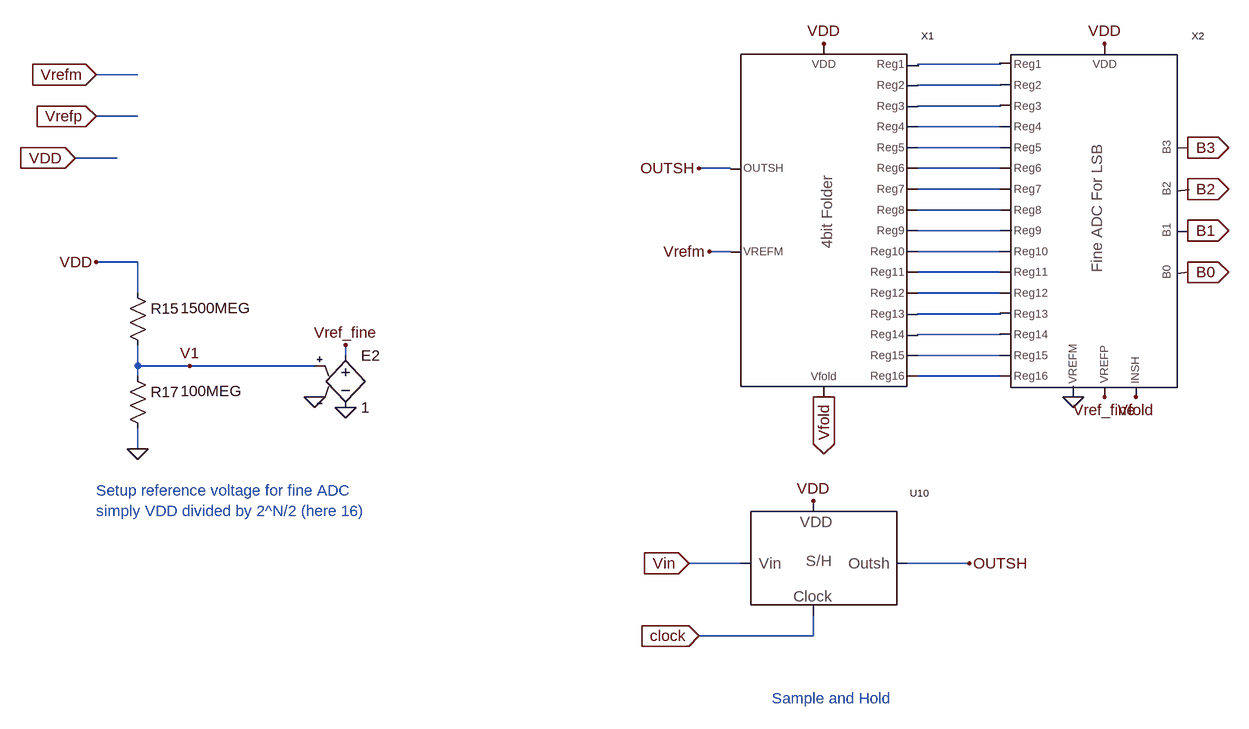
[diagram p0: schematic 4_bit_Folding_ADC.asc]
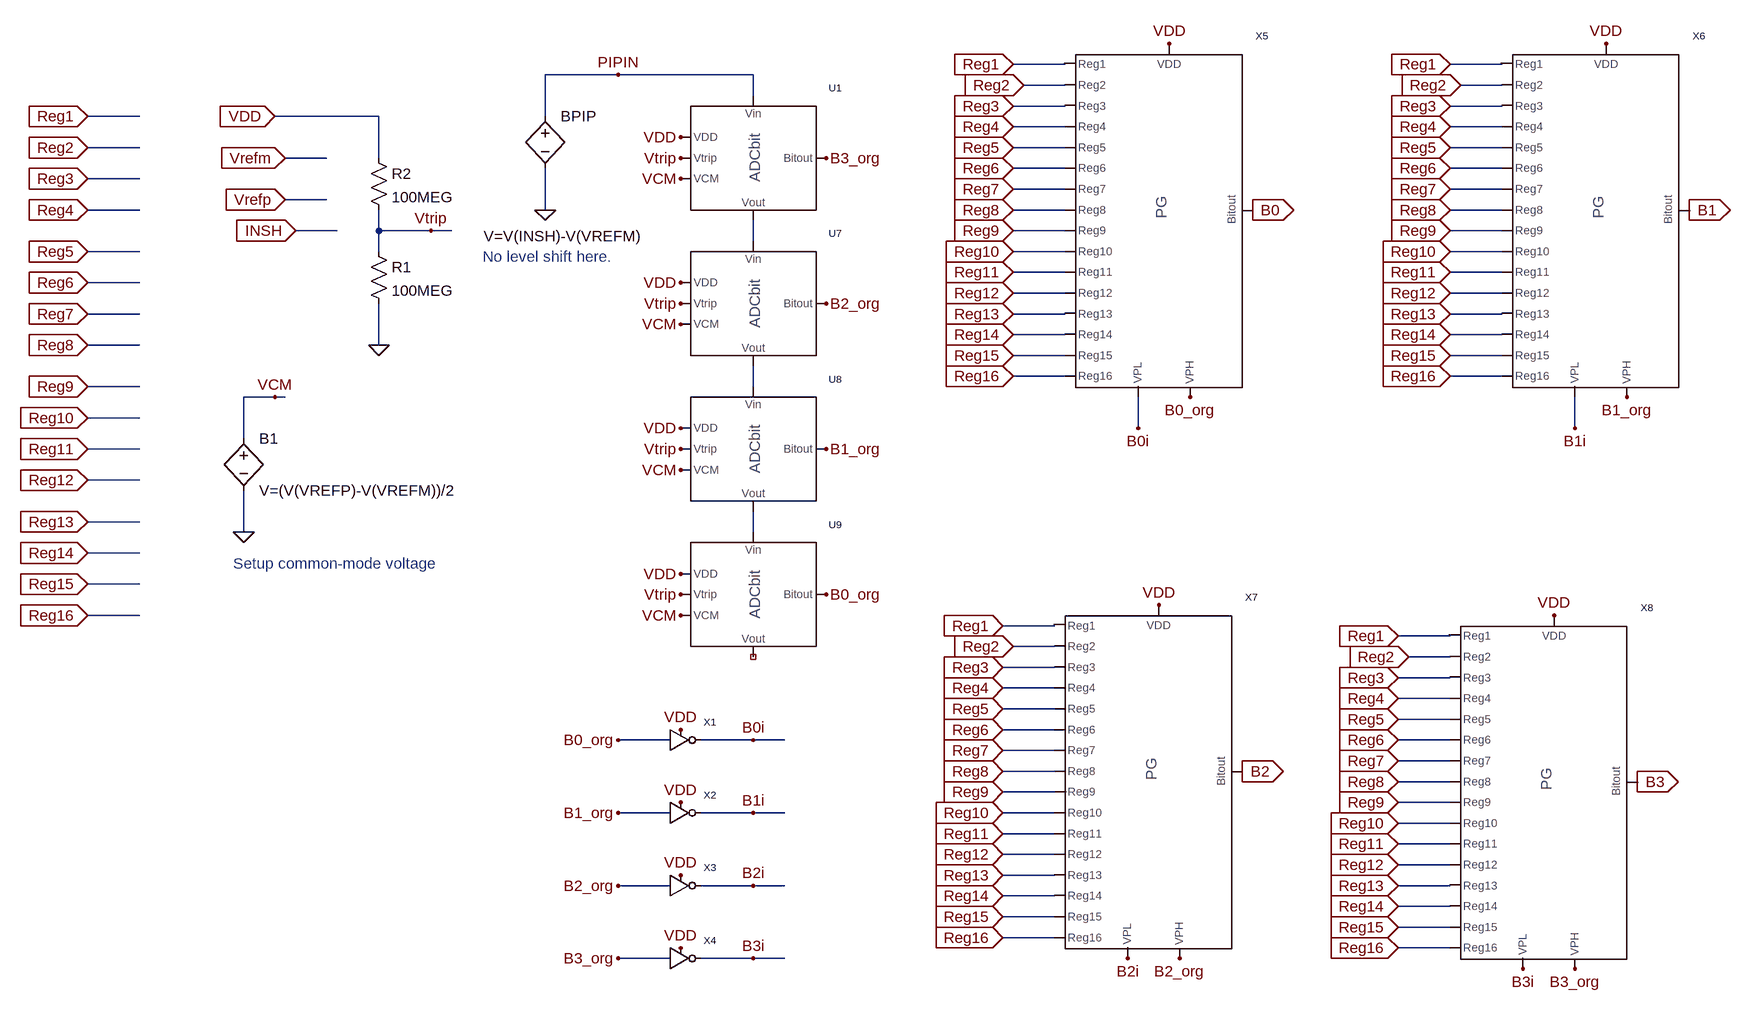
[diagram p1: sub-circuit 4_bit_fine_adc_lsb.asc]
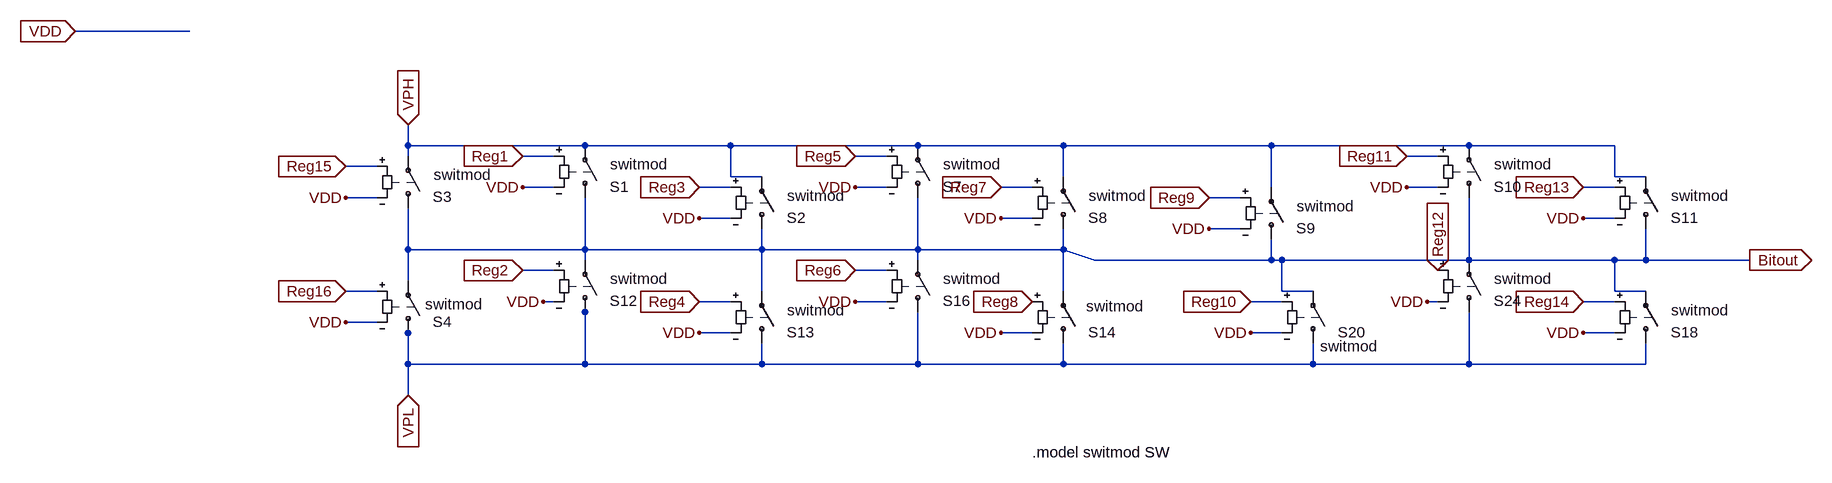
[diagram p2: sub-circuit pg.asc]
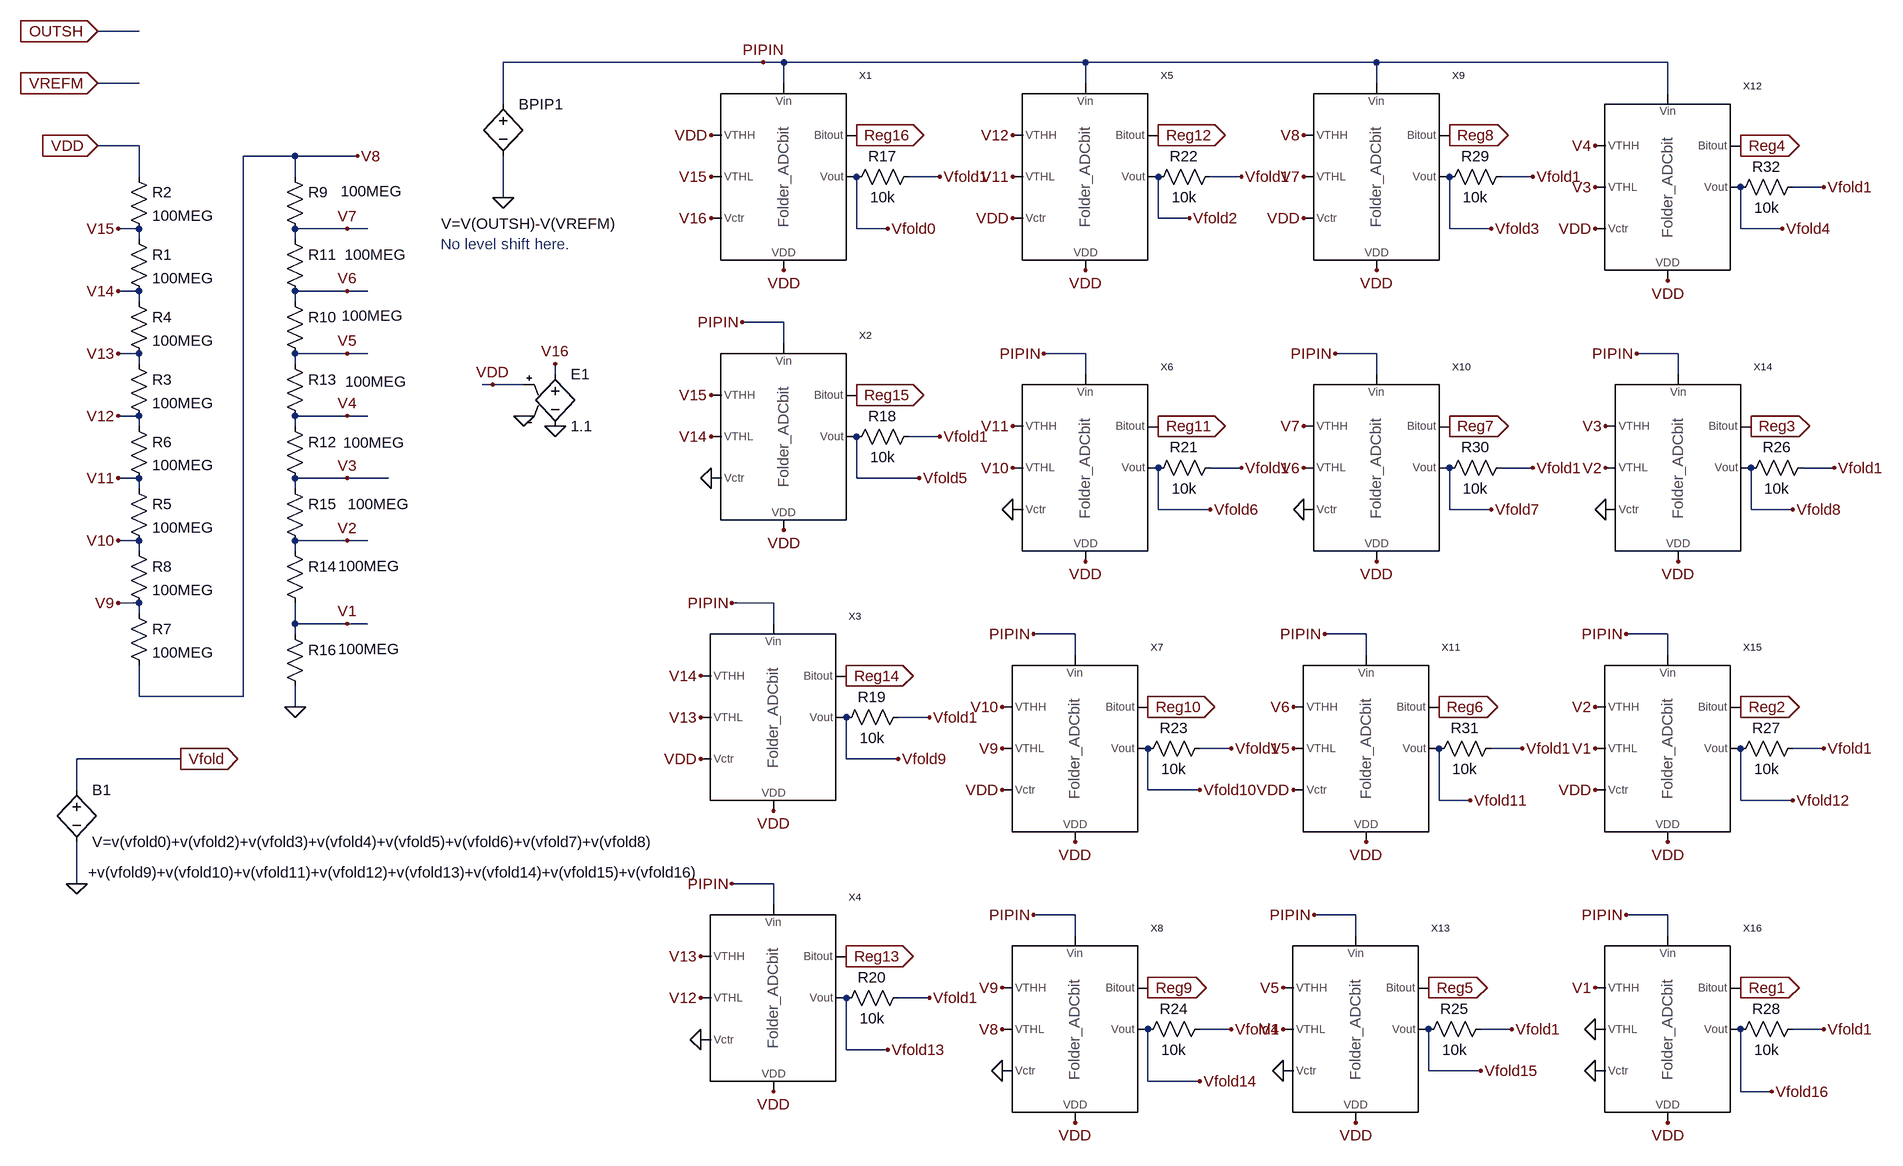
[diagram p3: sub-circuit 4bit_folder.asc]
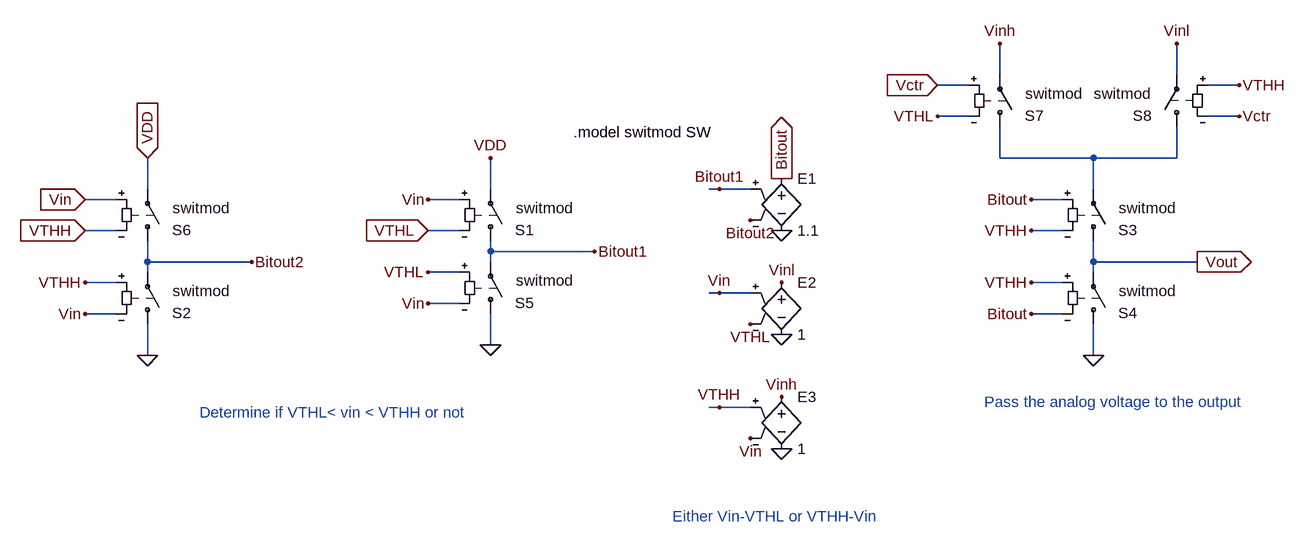
[diagram p4: sub-circuit folder_adcbit.asc]
4_bit_Folding_ADC.asc, the LTspice schematic file:
Version 4
SHEET 1 2852 696
WIRE 352 -1280 224 -1280
WIRE -976 -1264 -1040 -1264
WIRE 352 -1248 224 -1248
WIRE 352 -1216 224 -1216
WIRE -976 -1200 -1040 -1200
WIRE 352 -1184 224 -1184
WIRE 352 -1152 224 -1152
WIRE -1008 -1136 -1072 -1136
WIRE -64 -1120 -112 -1120
WIRE 352 -1120 224 -1120
WIRE 352 -1088 224 -1088
WIRE 352 -1056 224 -1056
WIRE 352 -1024 224 -1024
WIRE -64 -992 -96 -992
WIRE 352 -992 224 -992
WIRE -976 -976 -1040 -976
WIRE 352 -960 224 -960
WIRE -976 -928 -976 -976
WIRE 352 -928 224 -928
WIRE 352 -896 224 -896
WIRE 352 -864 224 -864
WIRE -656 -832 -656 -848
WIRE 352 -832 224 -832
WIRE -976 -816 -976 -848
WIRE -896 -816 -976 -816
WIRE -704 -816 -896 -816
WIRE -976 -800 -976 -816
WIRE 352 -800 224 -800
WIRE -976 -688 -976 -720
WIRE -48 -512 -128 -512
WIRE 304 -512 208 -512
WIRE 64 -400 64 -432
WIRE 64 -400 -112 -400
FLAG -112 -400 clock
IOPIN -112 -400 In
FLAG 304 -512 OUTSH
FLAG -976 -688 0
FLAG -1040 -976 VDD
FLAG -128 -512 Vin
IOPIN -128 -512 In
FLAG -1040 -1264 Vrefm
IOPIN -1040 -1264 In
FLAG -1040 -1200 Vrefp
IOPIN -1040 -1200 In
FLAG 64 -608 VDD
FLAG -896 -816 V1
FLAG 640 -1024 B1
IOPIN 640 -1024 Out
FLAG 640 -960 B0
IOPIN 640 -960 Out
FLAG -656 -752 0
FLAG -656 -848 Vref_fine
FLAG -704 -768 0
FLAG -96 -992 Vrefm
FLAG 80 -1312 VDD
FLAG 80 -768 Vfold
IOPIN 80 -768 Out
FLAG -1072 -1136 VDD
IOPIN -1072 -1136 In
FLAG 512 -768 Vref_fine
FLAG 464 -768 0
FLAG 560 -768 Vfold
FLAG 512 -1312 VDD
FLAG 640 -1152 B3
IOPIN 640 -1152 Out
FLAG 640 -1088 B2
IOPIN 640 -1088 Out
FLAG -112 -1120 OUTSH
SYMBOL Sample_and_hold -32 -448 R0
SYMATTR InstName U10
SYMBOL res -992 -944 R0
WINDOW 3 82 39 Left 0
SYMATTR Value 1500MEG
SYMATTR InstName R15
SYMBOL res -992 -816 R0
WINDOW 3 82 39 Left 0
SYMATTR Value 100MEG
SYMATTR InstName R17
SYMBOL e -656 -848 R0
SYMATTR InstName E2
SYMATTR Value 1
SYMBOL 4_bit_fine_ADC_LSB 512 -992 R0
SYMATTR InstName X2
SYMBOL 4bit_folder 0 -912 R0
SYMATTR InstName X1
TEXT 0 -304 Left 0 ;Sample and Hold
TEXT -1040 -624 Left 0 ;Setup reference voltage for fine ADC\nsimply VDD divided by 2^N/2 (here 16)

4_bit_fine_adc_lsb.asc, the sub-circuit schematic file:
Version 4
SHEET 1 4400 868
WIRE 1488 -1136 1408 -1136
WIRE 2160 -1136 2080 -1136
WIRE 800 -1120 688 -1120
WIRE 1008 -1120 800 -1120
WIRE 1488 -1104 1424 -1104
WIRE 2160 -1104 2096 -1104
WIRE 1008 -1088 1008 -1120
WIRE 1488 -1072 1408 -1072
WIRE 2160 -1072 2080 -1072
WIRE 64 -1056 -16 -1056
WIRE 432 -1056 272 -1056
WIRE 688 -1056 688 -1120
WIRE 1488 -1040 1408 -1040
WIRE 2160 -1040 2080 -1040
WIRE 64 -1008 -16 -1008
WIRE 1488 -1008 1408 -1008
WIRE 2160 -1008 2080 -1008
WIRE 352 -992 288 -992
WIRE 432 -992 432 -1056
WIRE 1488 -976 1408 -976
WIRE 2160 -976 2080 -976
WIRE 64 -960 -16 -960
WIRE 1488 -944 1408 -944
WIRE 2160 -944 2080 -944
WIRE 352 -928 288 -928
WIRE 64 -912 -16 -912
WIRE 688 -912 688 -976
WIRE 1488 -912 1408 -912
WIRE 2160 -912 2080 -912
WIRE 368 -880 304 -880
WIRE 432 -880 432 -912
WIRE 512 -880 432 -880
WIRE 544 -880 512 -880
WIRE 1488 -880 1408 -880
WIRE 2160 -880 2080 -880
WIRE 1008 -864 1008 -896
WIRE 64 -848 -16 -848
WIRE 432 -848 432 -880
WIRE 1488 -848 1408 -848
WIRE 2160 -848 2080 -848
WIRE 1488 -816 1408 -816
WIRE 2160 -816 2080 -816
WIRE 64 -800 -16 -800
WIRE 1488 -784 1408 -784
WIRE 2160 -784 2080 -784
WIRE 64 -752 -16 -752
WIRE 1488 -752 1408 -752
WIRE 2160 -752 2080 -752
WIRE 1488 -720 1408 -720
WIRE 2160 -720 2080 -720
WIRE 64 -704 -16 -704
WIRE 432 -704 432 -768
WIRE 1488 -688 1408 -688
WIRE 2160 -688 2080 -688
WIRE 1488 -656 1408 -656
WIRE 2160 -656 2080 -656
WIRE 64 -640 -16 -640
WIRE 1008 -640 1008 -672
WIRE 272 -624 224 -624
WIRE 288 -624 272 -624
WIRE 64 -592 -16 -592
WIRE 1600 -576 1600 -624
WIRE 2272 -576 2272 -624
WIRE 224 -560 224 -624
WIRE 64 -544 -16 -544
WIRE 64 -496 -16 -496
WIRE 64 -432 -16 -432
WIRE 224 -416 224 -480
WIRE 1008 -416 1008 -448
WIRE 64 -384 -16 -384
WIRE 64 -336 -16 -336
WIRE 64 -288 -16 -288
WIRE 1472 -272 1392 -272
WIRE 2080 -256 2000 -256
WIRE 1472 -240 1408 -240
WIRE 2080 -224 2016 -224
WIRE 1472 -208 1392 -208
WIRE 2080 -192 2000 -192
WIRE 1472 -176 1392 -176
WIRE 2080 -160 2000 -160
WIRE 1472 -144 1392 -144
WIRE 2080 -128 2000 -128
WIRE 1472 -112 1392 -112
WIRE 880 -96 800 -96
WIRE 1008 -96 928 -96
WIRE 1056 -96 1008 -96
WIRE 2080 -96 2000 -96
WIRE 1472 -80 1392 -80
WIRE 2080 -64 2000 -64
WIRE 1472 -48 1392 -48
WIRE 2080 -32 2000 -32
WIRE 1472 -16 1392 -16
WIRE 2080 0 2000 0
WIRE 880 16 800 16
WIRE 1008 16 928 16
WIRE 1056 16 1008 16
WIRE 1472 16 1392 16
WIRE 2080 32 2000 32
WIRE 1472 48 1392 48
WIRE 2080 64 2000 64
WIRE 1472 80 1392 80
WIRE 2080 96 2000 96
WIRE 1472 112 1392 112
WIRE 880 128 800 128
WIRE 1008 128 928 128
WIRE 1056 128 1008 128
WIRE 2080 128 2000 128
WIRE 1472 144 1392 144
WIRE 2080 160 2000 160
WIRE 1472 176 1392 176
WIRE 2080 192 2000 192
WIRE 1472 208 1392 208
WIRE 2080 224 2000 224
WIRE 880 240 800 240
WIRE 1008 240 928 240
WIRE 1056 240 1008 240
FLAG 512 -880 Vtrip
FLAG 432 -704 0
FLAG 272 -1056 VDD
IOPIN 272 -1056 In
FLAG 224 -416 0
FLAG 272 -624 VCM
FLAG 688 -912 0
FLAG 896 -992 Vtrip
FLAG 896 -1024 VDD
FLAG 896 -960 VCM
FLAG 896 -768 Vtrip
FLAG 896 -800 VDD
FLAG 896 -736 VCM
FLAG 1120 -768 B2_org
FLAG 896 -544 Vtrip
FLAG 896 -576 VDD
FLAG 896 -512 VCM
FLAG 1120 -544 B1_org
FLAG 896 -320 Vtrip
FLAG 896 -352 VDD
FLAG 896 -288 VCM
FLAG 1120 -320 B0_org
FLAG 800 -1120 PIPIN
FLAG 288 -992 Vrefm
IOPIN 288 -992 In
FLAG 288 -928 Vrefp
IOPIN 288 -928 In
FLAG 1120 -992 B3_org
FLAG 304 -880 INSH
IOPIN 304 -880 In
FLAG -16 -1056 Reg1
IOPIN -16 -1056 In
FLAG -16 -1008 Reg2
IOPIN -16 -1008 In
FLAG -16 -960 Reg3
IOPIN -16 -960 In
FLAG -16 -912 Reg4
IOPIN -16 -912 In
FLAG -16 -848 Reg5
IOPIN -16 -848 In
FLAG -16 -800 Reg6
IOPIN -16 -800 In
FLAG -16 -752 Reg7
IOPIN -16 -752 In
FLAG -16 -704 Reg8
IOPIN -16 -704 In
FLAG -16 -640 Reg9
IOPIN -16 -640 In
FLAG -16 -592 Reg10
IOPIN -16 -592 In
FLAG -16 -544 Reg11
IOPIN -16 -544 In
FLAG -16 -496 Reg12
IOPIN -16 -496 In
FLAG -16 -432 Reg13
IOPIN -16 -432 In
FLAG -16 -384 Reg14
IOPIN -16 -384 In
FLAG -16 -336 Reg15
IOPIN -16 -336 In
FLAG -16 -288 Reg16
IOPIN -16 -288 In
FLAG 800 -96 B0_org
FLAG 896 -112 VDD
FLAG 1008 -96 B0i
FLAG 800 16 B1_org
FLAG 896 0 VDD
FLAG 1008 16 B1i
FLAG 800 128 B2_org
FLAG 896 112 VDD
FLAG 1008 128 B2i
FLAG 800 240 B3_org
FLAG 896 224 VDD
FLAG 1008 240 B3i
FLAG 1408 -1136 Reg1
IOPIN 1408 -1136 In
FLAG 1424 -1104 Reg2
IOPIN 1424 -1104 In
FLAG 1408 -1072 Reg3
IOPIN 1408 -1072 In
FLAG 1408 -1040 Reg4
IOPIN 1408 -1040 In
FLAG 1408 -1008 Reg5
IOPIN 1408 -1008 In
FLAG 1408 -976 Reg6
IOPIN 1408 -976 In
FLAG 1408 -944 Reg7
IOPIN 1408 -944 In
FLAG 1408 -912 Reg8
IOPIN 1408 -912 In
FLAG 1408 -880 Reg9
IOPIN 1408 -880 In
FLAG 1408 -848 Reg10
IOPIN 1408 -848 In
FLAG 1408 -816 Reg11
IOPIN 1408 -816 In
FLAG 1408 -784 Reg12
IOPIN 1408 -784 In
FLAG 1408 -752 Reg13
IOPIN 1408 -752 In
FLAG 1408 -720 Reg14
IOPIN 1408 -720 In
FLAG 1408 -688 Reg15
IOPIN 1408 -688 In
FLAG 1408 -656 Reg16
IOPIN 1408 -656 In
FLAG 1648 -1168 VDD
FLAG 2080 -1136 Reg1
IOPIN 2080 -1136 In
FLAG 2096 -1104 Reg2
IOPIN 2096 -1104 In
FLAG 2080 -1072 Reg3
IOPIN 2080 -1072 In
FLAG 2080 -1040 Reg4
IOPIN 2080 -1040 In
FLAG 2080 -1008 Reg5
IOPIN 2080 -1008 In
FLAG 2080 -976 Reg6
IOPIN 2080 -976 In
FLAG 2080 -944 Reg7
IOPIN 2080 -944 In
FLAG 2080 -912 Reg8
IOPIN 2080 -912 In
FLAG 2080 -880 Reg9
IOPIN 2080 -880 In
FLAG 2080 -848 Reg10
IOPIN 2080 -848 In
FLAG 2080 -816 Reg11
IOPIN 2080 -816 In
FLAG 2080 -784 Reg12
IOPIN 2080 -784 In
FLAG 2080 -752 Reg13
IOPIN 2080 -752 In
FLAG 2080 -720 Reg14
IOPIN 2080 -720 In
FLAG 2080 -688 Reg15
IOPIN 2080 -688 In
FLAG 2080 -656 Reg16
IOPIN 2080 -656 In
FLAG 2320 -1168 VDD
FLAG 1392 -272 Reg1
IOPIN 1392 -272 In
FLAG 1408 -240 Reg2
IOPIN 1408 -240 In
FLAG 1392 -208 Reg3
IOPIN 1392 -208 In
FLAG 1392 -176 Reg4
IOPIN 1392 -176 In
FLAG 1392 -144 Reg5
IOPIN 1392 -144 In
FLAG 1392 -112 Reg6
IOPIN 1392 -112 In
FLAG 1392 -80 Reg7
IOPIN 1392 -80 In
FLAG 1392 -48 Reg8
IOPIN 1392 -48 In
FLAG 1392 -16 Reg9
IOPIN 1392 -16 In
FLAG 1392 16 Reg10
IOPIN 1392 16 In
FLAG 1392 48 Reg11
IOPIN 1392 48 In
FLAG 1392 80 Reg12
IOPIN 1392 80 In
FLAG 1392 112 Reg13
IOPIN 1392 112 In
FLAG 1392 144 Reg14
IOPIN 1392 144 In
FLAG 1392 176 Reg15
IOPIN 1392 176 In
FLAG 1392 208 Reg16
IOPIN 1392 208 In
FLAG 1632 -304 VDD
FLAG 2000 -256 Reg1
IOPIN 2000 -256 In
FLAG 2016 -224 Reg2
IOPIN 2016 -224 In
FLAG 2000 -192 Reg3
IOPIN 2000 -192 In
FLAG 2000 -160 Reg4
IOPIN 2000 -160 In
FLAG 2000 -128 Reg5
IOPIN 2000 -128 In
FLAG 2000 -96 Reg6
IOPIN 2000 -96 In
FLAG 2000 -64 Reg7
IOPIN 2000 -64 In
FLAG 2000 -32 Reg8
IOPIN 2000 -32 In
FLAG 2000 0 Reg9
IOPIN 2000 0 In
FLAG 2000 32 Reg10
IOPIN 2000 32 In
FLAG 2000 64 Reg11
IOPIN 2000 64 In
FLAG 2000 96 Reg12
IOPIN 2000 96 In
FLAG 2000 128 Reg13
IOPIN 2000 128 In
FLAG 2000 160 Reg14
IOPIN 2000 160 In
FLAG 2000 192 Reg15
IOPIN 2000 192 In
FLAG 2000 224 Reg16
IOPIN 2000 224 In
FLAG 2240 -288 VDD
FLAG 1680 -624 B0_org
FLAG 1600 -576 B0i
FLAG 2272 -576 B1i
FLAG 2352 -624 B1_org
FLAG 1664 240 B2_org
FLAG 2272 256 B3_org
FLAG 2192 256 B3i
FLAG 1584 240 B2i
FLAG 1760 -48 B2
IOPIN 1760 -48 Out
FLAG 2448 -912 B1
IOPIN 2448 -912 Out
FLAG 2368 -32 B3
IOPIN 2368 -32 Out
FLAG 1776 -912 B0
IOPIN 1776 -912 Out
SYMBOL res 416 -864 R0
SYMATTR InstName R1
SYMATTR Value 100MEG
SYMBOL res 416 -1008 R0
SYMATTR InstName R2
SYMATTR Value 100MEG
SYMBOL bv 224 -576 R0
SYMATTR InstName B1
SYMATTR Value V=(V(VREFP)-V(VREFM))/2
SYMBOL bv 688 -1072 R0
WINDOW 3 -95 200 Left 0
SYMATTR Value V=V(INSH)-V(VREFM)
SYMATTR InstName BPIP
SYMBOL ADCbit 864 -976 R0
SYMATTR InstName U1
SYMBOL ADCbit 864 -752 R0
SYMATTR InstName U7
SYMBOL ADCbit 864 -528 R0
SYMATTR InstName U8
SYMBOL ADCbit 864 -304 R0
SYMATTR InstName U9
SYMBOL inverter 880 -96 R0
SYMATTR InstName X1
SYMBOL inverter 880 16 R0
SYMATTR InstName X2
SYMBOL inverter 880 128 R0
SYMATTR InstName X3
SYMBOL inverter 880 240 R0
SYMATTR InstName X4
SYMBOL PG 1648 -848 R0
SYMATTR InstName X5
SYMBOL PG 2320 -848 R0
SYMATTR InstName X6
SYMBOL PG 1632 16 R0
SYMATTR InstName X7
SYMBOL PG 2240 32 R0
SYMATTR InstName X8
TEXT 592 -840 Left 0 ;No level shift here.
TEXT 208 -368 Left 0 ;Setup common-mode voltage

pg.asc, the sub-circuit schematic file:
Version 4
SHEET 1 3216 696
WIRE 256 -1472 80 -1472
WIRE 592 -1296 592 -1328
WIRE 864 -1296 592 -1296
WIRE 1088 -1296 864 -1296
WIRE 1376 -1296 1088 -1296
WIRE 1600 -1296 1376 -1296
WIRE 1920 -1296 1600 -1296
WIRE 2224 -1296 1920 -1296
WIRE 2448 -1296 2224 -1296
WIRE 592 -1280 592 -1296
WIRE 816 -1280 768 -1280
WIRE 1328 -1280 1280 -1280
WIRE 2176 -1280 2128 -1280
WIRE 544 -1264 496 -1264
WIRE 1088 -1248 1088 -1296
WIRE 1136 -1248 1088 -1248
WIRE 1600 -1248 1600 -1296
WIRE 2448 -1248 2448 -1296
WIRE 2496 -1248 2448 -1248
WIRE 816 -1232 768 -1232
WIRE 1088 -1232 1040 -1232
WIRE 1328 -1232 1280 -1232
WIRE 1552 -1232 1504 -1232
WIRE 1920 -1232 1920 -1296
WIRE 2176 -1232 2128 -1232
WIRE 2448 -1232 2400 -1232
WIRE 544 -1216 496 -1216
WIRE 1872 -1216 1824 -1216
WIRE 1088 -1184 1040 -1184
WIRE 1552 -1184 1504 -1184
WIRE 2448 -1184 2400 -1184
WIRE 1872 -1168 1824 -1168
WIRE 592 -1136 592 -1200
WIRE 864 -1136 864 -1216
WIRE 864 -1136 592 -1136
WIRE 1136 -1136 1136 -1168
WIRE 1136 -1136 864 -1136
WIRE 1376 -1136 1376 -1216
WIRE 1376 -1136 1136 -1136
WIRE 1600 -1136 1600 -1168
WIRE 1600 -1136 1376 -1136
WIRE 864 -1120 864 -1136
WIRE 1376 -1120 1376 -1136
WIRE 1648 -1120 1600 -1136
WIRE 1920 -1120 1920 -1152
WIRE 1920 -1120 1648 -1120
WIRE 1936 -1120 1920 -1120
WIRE 2224 -1120 2224 -1216
WIRE 2224 -1120 1936 -1120
WIRE 2448 -1120 2224 -1120
WIRE 2496 -1120 2496 -1168
WIRE 2496 -1120 2448 -1120
WIRE 2656 -1120 2496 -1120
WIRE 816 -1104 768 -1104
WIRE 1328 -1104 1280 -1104
WIRE 592 -1088 592 -1136
WIRE 544 -1072 496 -1072
WIRE 1136 -1072 1136 -1136
WIRE 1600 -1072 1600 -1136
WIRE 1936 -1072 1936 -1120
WIRE 1984 -1072 1936 -1072
WIRE 2448 -1072 2448 -1120
WIRE 2496 -1072 2448 -1072
WIRE 816 -1056 800 -1056
WIRE 1088 -1056 1040 -1056
WIRE 1328 -1056 1280 -1056
WIRE 1568 -1056 1552 -1056
WIRE 1936 -1056 1888 -1056
WIRE 2176 -1056 2160 -1056
WIRE 2448 -1056 2400 -1056
WIRE 864 -1040 864 -1056
WIRE 544 -1024 496 -1024
WIRE 592 -1008 592 -1024
WIRE 1088 -1008 1040 -1008
WIRE 1552 -1008 1504 -1008
WIRE 1936 -1008 1888 -1008
WIRE 2448 -1008 2400 -1008
WIRE 592 -960 592 -1008
WIRE 864 -960 864 -1040
WIRE 864 -960 592 -960
WIRE 1136 -960 1136 -992
WIRE 1136 -960 864 -960
WIRE 1376 -960 1376 -1040
WIRE 1376 -960 1136 -960
WIRE 1600 -960 1600 -992
WIRE 1600 -960 1376 -960
WIRE 1984 -960 1984 -992
WIRE 1984 -960 1600 -960
WIRE 2224 -960 2224 -1040
WIRE 2224 -960 1984 -960
WIRE 2496 -960 2496 -992
WIRE 2496 -960 2224 -960
WIRE 592 -912 592 -960
FLAG 496 -1216 VDD
FLAG 2656 -1120 Bitout
IOPIN 2656 -1120 Out
FLAG 592 -912 VPL
IOPIN 592 -912 In
FLAG 592 -1328 VPH
IOPIN 592 -1328 In
FLAG 496 -1264 Reg15
IOPIN 496 -1264 In
FLAG 768 -1232 VDD
FLAG 768 -1280 Reg1
IOPIN 768 -1280 In
FLAG 1040 -1184 VDD
FLAG 1040 -1232 Reg3
IOPIN 1040 -1232 In
FLAG 1280 -1232 VDD
FLAG 1280 -1280 Reg5
IOPIN 1280 -1280 In
FLAG 1504 -1184 VDD
FLAG 1504 -1232 Reg7
IOPIN 1504 -1232 In
FLAG 1824 -1168 VDD
FLAG 1824 -1216 Reg9
IOPIN 1824 -1216 In
FLAG 2128 -1232 VDD
FLAG 2128 -1280 Reg11
IOPIN 2128 -1280 In
FLAG 2400 -1184 VDD
FLAG 2400 -1232 Reg13
IOPIN 2400 -1232 In
FLAG 80 -1472 VDD
IOPIN 80 -1472 In
FLAG 496 -1072 Reg16
IOPIN 496 -1072 In
FLAG 768 -1104 Reg2
IOPIN 768 -1104 In
FLAG 1040 -1056 Reg4
IOPIN 1040 -1056 In
FLAG 1280 -1104 Reg6
IOPIN 1280 -1104 In
FLAG 1552 -1056 Reg8
IOPIN 1552 -1056 In
FLAG 1888 -1056 Reg10
IOPIN 1888 -1056 In
FLAG 2176 -1104 Reg12
IOPIN 2176 -1104 In
FLAG 2400 -1056 Reg14
IOPIN 2400 -1056 In
FLAG 496 -1024 VDD
FLAG 1040 -1008 VDD
FLAG 800 -1056 VDD
FLAG 1280 -1056 VDD
FLAG 1504 -1008 VDD
FLAG 1888 -1008 VDD
FLAG 2160 -1056 VDD
FLAG 2400 -1008 VDD
SYMBOL sw 592 -1184 M180
WINDOW 3 24 -12 Left 0
WINDOW 38 39 67 Left 0
WINDOW 0 38 33 Left 0
SYMATTR Value ""
SYMATTR SpiceModel switmod
SYMATTR InstName S3
SYMBOL sw 592 -992 M180
WINDOW 3 24 -12 Left 0
WINDOW 38 26 60 Left 0
WINDOW 0 38 33 Left 0
SYMATTR Value ""
SYMATTR SpiceModel switmod
SYMATTR InstName S4
SYMBOL sw 864 -1200 M180
WINDOW 3 24 -12 Left 0
WINDOW 38 39 67 Left 0
WINDOW 0 38 33 Left 0
SYMATTR Value ""
SYMATTR SpiceModel switmod
SYMATTR InstName S1
SYMBOL sw 1136 -1152 M180
WINDOW 3 24 -12 Left 0
WINDOW 38 39 67 Left 0
WINDOW 0 38 33 Left 0
SYMATTR Value ""
SYMATTR SpiceModel switmod
SYMATTR InstName S2
SYMBOL sw 1376 -1200 M180
WINDOW 3 24 -12 Left 0
WINDOW 38 39 67 Left 0
WINDOW 0 38 33 Left 0
SYMATTR Value ""
SYMATTR SpiceModel switmod
SYMATTR InstName S7
SYMBOL sw 1600 -1152 M180
WINDOW 3 24 -12 Left 0
WINDOW 38 39 67 Left 0
WINDOW 0 38 33 Left 0
SYMATTR Value ""
SYMATTR SpiceModel switmod
SYMATTR InstName S8
SYMBOL sw 1920 -1136 M180
WINDOW 3 24 -12 Left 0
WINDOW 38 39 67 Left 0
WINDOW 0 38 33 Left 0
SYMATTR Value ""
SYMATTR SpiceModel switmod
SYMATTR InstName S9
SYMBOL sw 2224 -1200 M180
WINDOW 3 24 -12 Left 0
WINDOW 38 39 67 Left 0
WINDOW 0 38 33 Left 0
SYMATTR Value ""
SYMATTR SpiceModel switmod
SYMATTR InstName S10
SYMBOL sw 2496 -1152 M180
WINDOW 3 24 -12 Left 0
WINDOW 38 39 67 Left 0
WINDOW 0 38 33 Left 0
SYMATTR Value ""
SYMATTR SpiceModel switmod
SYMATTR InstName S11
SYMBOL sw 864 -1024 M180
WINDOW 3 24 -12 Left 0
WINDOW 38 39 67 Left 0
WINDOW 0 38 33 Left 0
SYMATTR Value ""
SYMATTR SpiceModel switmod
SYMATTR InstName S12
SYMBOL sw 1136 -976 M180
WINDOW 3 24 -12 Left 0
WINDOW 38 39 67 Left 0
WINDOW 0 38 33 Left 0
SYMATTR Value ""
SYMATTR SpiceModel switmod
SYMATTR InstName S13
SYMBOL sw 1376 -1024 M180
WINDOW 3 24 -12 Left 0
WINDOW 38 39 67 Left 0
WINDOW 0 38 33 Left 0
SYMATTR Value ""
SYMATTR SpiceModel switmod
SYMATTR InstName S16
SYMBOL sw 1984 -976 M180
WINDOW 3 24 -12 Left 0
WINDOW 38 11 11 Left 0
WINDOW 0 38 33 Left 0
SYMATTR Value ""
SYMATTR SpiceModel switmod
SYMATTR InstName S20
SYMBOL sw 2224 -1024 M180
WINDOW 3 24 -12 Left 0
WINDOW 38 39 67 Left 0
WINDOW 0 38 33 Left 0
SYMATTR Value ""
SYMATTR SpiceModel switmod
SYMATTR InstName S24
SYMBOL sw 2496 -976 M180
WINDOW 3 24 -12 Left 0
WINDOW 38 39 67 Left 0
WINDOW 0 38 33 Left 0
SYMATTR Value ""
SYMATTR SpiceModel switmod
SYMATTR InstName S18
SYMBOL sw 1600 -976 M180
WINDOW 3 24 -12 Left 0
WINDOW 38 35 73 Left 0
WINDOW 0 38 33 Left 0
SYMATTR Value ""
SYMATTR SpiceModel switmod
SYMATTR InstName S14
TEXT 1552 -824 Left 0 !.model switmod SW

4bit_folder.asc, the sub-circuit schematic file:
Version 4
SHEET 1 880 680
WIRE -2192 -1504 -2256 -1504
WIRE -1232 -1456 -1632 -1456
WIRE -1200 -1456 -1232 -1456
WIRE -736 -1456 -1200 -1456
WIRE -288 -1456 -736 -1456
WIRE 160 -1456 -288 -1456
WIRE -2192 -1424 -2256 -1424
WIRE -1200 -1424 -1200 -1456
WIRE -736 -1424 -736 -1456
WIRE -288 -1424 -288 -1456
WIRE 160 -1408 160 -1456
WIRE -1632 -1392 -1632 -1456
WIRE -2192 -1328 -2256 -1328
WIRE -1952 -1312 -2032 -1312
WIRE -1856 -1312 -1952 -1312
WIRE -2192 -1280 -2192 -1328
WIRE -1952 -1280 -1952 -1312
WIRE -960 -1280 -1008 -1280
WIRE -496 -1280 -544 -1280
WIRE -48 -1280 -96 -1280
WIRE 400 -1264 352 -1264
WIRE -1632 -1248 -1632 -1312
WIRE -624 -1216 -624 -1280
WIRE -576 -1216 -624 -1216
WIRE -2192 -1200 -2224 -1200
WIRE -1872 -1200 -1952 -1200
WIRE -1840 -1200 -1872 -1200
WIRE -1088 -1200 -1088 -1280
WIRE -1040 -1200 -1088 -1200
WIRE -176 -1200 -176 -1280
WIRE -112 -1200 -176 -1200
WIRE 272 -1200 272 -1264
WIRE 336 -1200 272 -1200
WIRE -2192 -1184 -2192 -1200
WIRE -1952 -1184 -1952 -1200
WIRE -2192 -1104 -2224 -1104
WIRE -1872 -1104 -1952 -1104
WIRE -1840 -1104 -1872 -1104
WIRE -2192 -1088 -2192 -1104
WIRE -1952 -1088 -1952 -1104
WIRE -1200 -1056 -1264 -1056
WIRE -1200 -1024 -1200 -1056
WIRE -2192 -1008 -2224 -1008
WIRE -1872 -1008 -1952 -1008
WIRE -1840 -1008 -1872 -1008
WIRE -736 -1008 -800 -1008
WIRE -288 -1008 -352 -1008
WIRE 176 -1008 112 -1008
WIRE -2192 -992 -2192 -1008
WIRE -1952 -992 -1952 -1008
WIRE -1552 -976 -1552 -992
WIRE -736 -976 -736 -1008
WIRE -288 -976 -288 -1008
WIRE 176 -976 176 -1008
WIRE -1648 -960 -1664 -960
WIRE -1600 -960 -1648 -960
WIRE -2192 -912 -2224 -912
WIRE -1872 -912 -1952 -912
WIRE -1840 -912 -1872 -912
WIRE -2192 -896 -2192 -912
WIRE -1952 -896 -1952 -912
WIRE -960 -880 -1008 -880
WIRE -496 -832 -544 -832
WIRE -48 -832 -96 -832
WIRE 416 -832 368 -832
WIRE -2192 -816 -2224 -816
WIRE -1872 -816 -1952 -816
WIRE -1808 -816 -1872 -816
WIRE -1088 -816 -1088 -880
WIRE -992 -816 -1088 -816
WIRE -2192 -800 -2192 -816
WIRE -1952 -800 -1952 -816
WIRE -624 -768 -624 -832
WIRE -544 -768 -624 -768
WIRE -176 -768 -176 -832
WIRE -112 -768 -176 -768
WIRE 288 -768 288 -832
WIRE 352 -768 288 -768
WIRE -2192 -720 -2224 -720
WIRE -1872 -720 -1952 -720
WIRE -1840 -720 -1872 -720
WIRE -2192 -704 -2192 -720
WIRE -1952 -704 -1952 -720
WIRE -2192 -624 -2224 -624
WIRE -1216 -624 -1280 -624
WIRE -2192 -608 -2192 -624
WIRE -1952 -592 -1952 -624
WIRE -1872 -592 -1952 -592
WIRE -1840 -592 -1872 -592
WIRE -1216 -592 -1216 -624
WIRE -1952 -576 -1952 -592
WIRE -752 -576 -816 -576
WIRE -304 -576 -368 -576
WIRE 160 -576 96 -576
WIRE -752 -544 -752 -576
WIRE -304 -544 -304 -576
WIRE 160 -544 160 -576
WIRE -2192 -480 -2192 -528
WIRE -2032 -480 -2032 -1312
WIRE -2032 -480 -2192 -480
WIRE -1952 -464 -1952 -496
WIRE -976 -448 -1024 -448
WIRE -512 -400 -560 -400
WIRE -64 -400 -112 -400
WIRE 400 -400 352 -400
WIRE -2128 -384 -2288 -384
WIRE -1104 -384 -1104 -448
WIRE -1024 -384 -1104 -384
WIRE -2288 -336 -2288 -384
WIRE -640 -336 -640 -400
WIRE -560 -336 -640 -336
WIRE -192 -320 -192 -400
WIRE -144 -320 -192 -320
WIRE 272 -320 272 -400
WIRE 352 -320 272 -320
WIRE -2288 -192 -2288 -256
WIRE -1216 -192 -1280 -192
WIRE -1216 -160 -1216 -192
WIRE -752 -144 -816 -144
WIRE -320 -144 -384 -144
WIRE 160 -144 96 -144
WIRE -752 -112 -752 -144
WIRE -320 -112 -320 -144
WIRE 160 -112 160 -144
WIRE -976 -16 -1024 -16
WIRE -512 32 -560 32
WIRE -80 32 -128 32
WIRE 400 32 352 32
WIRE -1104 64 -1104 -16
WIRE -1040 64 -1104 64
WIRE -208 96 -208 32
WIRE -128 96 -208 96
WIRE -640 112 -640 32
WIRE -560 112 -640 112
WIRE 272 128 272 32
WIRE 320 128 272 128
FLAG -1856 -1312 V8
FLAG -1952 -464 0
FLAG -2256 -1328 VDD
IOPIN -2256 -1328 In
FLAG -1632 -1248 0
FLAG -1312 -1280 V15
FLAG -1312 -1344 VDD
FLAG -1232 -1456 PIPIN
FLAG -1872 -1200 V7
FLAG -1872 -1104 V6
FLAG -1872 -1008 V5
FLAG -1872 -912 V4
FLAG -1872 -816 V3
FLAG -1872 -720 V2
FLAG -2224 -1200 V15
FLAG -2224 -1104 V14
FLAG -2224 -1008 V13
FLAG -2224 -912 V12
FLAG -2224 -816 V11
FLAG -2224 -720 V10
FLAG -2224 -624 V9
FLAG -1872 -592 V1
FLAG -1200 -1136 VDD
FLAG -1312 -880 V14
FLAG -1312 -944 V15
FLAG -1264 -1056 PIPIN
FLAG -1200 -736 VDD
FLAG -1328 -448 V13
FLAG -1328 -512 V14
FLAG -1280 -624 PIPIN
FLAG -1216 -304 VDD
FLAG -1328 -16 V12
FLAG -1328 -80 V13
FLAG -1280 -192 PIPIN
FLAG -1216 128 VDD
FLAG -848 -1280 V11
FLAG -848 -1344 V12
FLAG -736 -1136 VDD
FLAG -848 -832 V10
FLAG -848 -896 V11
FLAG -800 -1008 PIPIN
FLAG -736 -688 VDD
FLAG -864 -400 V9
FLAG -864 -464 V10
FLAG -816 -576 PIPIN
FLAG -752 -256 VDD
FLAG -864 32 V8
FLAG -864 -32 V9
FLAG -816 -144 PIPIN
FLAG -752 176 VDD
FLAG -400 -1280 V7
FLAG -400 -1344 V8
FLAG -288 -1136 VDD
FLAG -400 -832 V6
FLAG -400 -896 V7
FLAG -352 -1008 PIPIN
FLAG -288 -688 VDD
FLAG -416 -400 V5
FLAG -416 -464 V6
FLAG -368 -576 PIPIN
FLAG -304 -256 VDD
FLAG 48 -1264 V3
FLAG 48 -1328 V4
FLAG -384 -144 PIPIN
FLAG 160 -1120 VDD
FLAG -432 32 V4
FLAG -432 -32 V5
FLAG -960 -1280 Vfold1
FLAG -320 176 VDD
FLAG 64 -832 V2
FLAG 64 -896 V3
FLAG 112 -1008 PIPIN
FLAG 176 -688 VDD
FLAG 48 -400 V1
FLAG 48 -464 V2
FLAG 96 -576 PIPIN
FLAG 160 -256 VDD
FLAG 48 32 0
FLAG 48 -32 V1
FLAG 96 -144 PIPIN
FLAG 160 176 VDD
FLAG -496 -1280 Vfold1
FLAG -432 96 0
FLAG -864 96 0
FLAG -1328 48 0
FLAG -416 -336 VDD
FLAG 48 -336 VDD
FLAG -864 -336 VDD
FLAG -1328 -384 VDD
FLAG -848 -1216 VDD
FLAG -400 -1216 VDD
FLAG 48 -1200 VDD
FLAG 48 96 0
FLAG 64 -768 0
FLAG -400 -768 0
FLAG -848 -768 0
FLAG -1312 -816 0
FLAG -1312 -1216 V16
FLAG -1552 -896 0
FLAG -1552 -992 V16
FLAG -1600 -912 0
FLAG -1648 -960 VDD
FLAG -48 -1280 Vfold1
FLAG 400 -1264 Vfold1
FLAG 416 -832 Vfold1
FLAG 400 -400 Vfold1
FLAG 400 32 Vfold1
FLAG -80 32 Vfold1
FLAG -64 -400 Vfold1
FLAG -48 -832 Vfold1
FLAG -496 -832 Vfold1
FLAG -512 -400 Vfold1
FLAG -512 32 Vfold1
FLAG -976 -16 Vfold1
FLAG -976 -448 Vfold1
FLAG -960 -880 Vfold1
FLAG -2256 -1424 VREFM
IOPIN -2256 -1424 In
FLAG -2256 -1504 OUTSH
IOPIN -2256 -1504 In
FLAG -1088 -1344 Reg16
IOPIN -1088 -1344 Out
FLAG -1088 -944 Reg15
IOPIN -1088 -944 Out
FLAG -1104 -512 Reg14
IOPIN -1104 -512 Out
FLAG -1104 -80 Reg13
IOPIN -1104 -80 Out
FLAG -624 -1344 Reg12
IOPIN -624 -1344 Out
FLAG -624 -896 Reg11
IOPIN -624 -896 Out
FLAG -640 -464 Reg10
IOPIN -640 -464 Out
FLAG -640 -32 Reg9
IOPIN -640 -32 Out
FLAG -176 -1344 Reg8
IOPIN -176 -1344 Out
FLAG -176 -896 Reg7
IOPIN -176 -896 Out
FLAG -192 -464 Reg6
IOPIN -192 -464 Out
FLAG -208 -32 Reg5
IOPIN -208 -32 Out
FLAG 272 -1328 Reg4
IOPIN 272 -1328 Out
FLAG 288 -896 Reg3
IOPIN 288 -896 Out
FLAG 272 -464 Reg2
IOPIN 272 -464 Out
FLAG 272 -32 Reg1
IOPIN 272 -32 Out
FLAG -1040 -1200 Vfold0
FLAG -992 -816 Vfold5
FLAG -1024 -384 Vfold9
FLAG -1040 64 Vfold13
FLAG -560 112 Vfold14
FLAG -560 -336 Vfold10
FLAG -544 -768 Vfold6
FLAG -576 -1216 Vfold2
FLAG -112 -1200 Vfold3
FLAG -112 -768 Vfold7
FLAG -144 -320 Vfold11
FLAG -128 96 Vfold15
FLAG 320 128 Vfold16
FLAG 352 -320 Vfold12
FLAG 352 -768 Vfold8
FLAG 336 -1200 Vfold4
FLAG -2288 -192 0
FLAG -2128 -384 Vfold
IOPIN -2128 -384 Out
SYMBOL res -2208 -1200 R0
SYMATTR InstName R1
SYMATTR Value 100MEG
SYMBOL res -2208 -1296 R0
SYMATTR InstName R2
SYMATTR Value 100MEG
SYMBOL bv -1632 -1408 R0
WINDOW 3 -95 200 Left 0
SYMATTR Value V=V(OUTSH)-V(VREFM)
SYMATTR InstName BPIP1
SYMBOL res -2208 -1008 R0
SYMATTR InstName R3
SYMATTR Value 100MEG
SYMBOL res -2208 -1104 R0
SYMATTR InstName R4
SYMATTR Value 100MEG
SYMBOL res -2208 -816 R0
SYMATTR InstName R5
SYMATTR Value 100MEG
SYMBOL res -2208 -912 R0
SYMATTR InstName R6
SYMATTR Value 100MEG
SYMBOL res -2208 -624 R0
SYMATTR InstName R7
SYMATTR Value 100MEG
SYMBOL res -2208 -720 R0
SYMATTR InstName R8
SYMATTR Value 100MEG
SYMBOL res -1968 -1296 R0
WINDOW 3 86 38 Left 0
SYMATTR Value 100MEG
SYMATTR InstName R9
SYMBOL res -1968 -1104 R0
WINDOW 3 88 38 Left 0
SYMATTR Value 100MEG
SYMATTR InstName R10
SYMBOL res -1968 -1200 R0
WINDOW 3 92 40 Left 0
SYMATTR Value 100MEG
SYMATTR InstName R11
SYMBOL res -1968 -912 R0
WINDOW 3 90 41 Left 0
SYMATTR Value 100MEG
SYMATTR InstName R12
SYMBOL res -1968 -1008 R0
WINDOW 3 93 43 Left 0
SYMATTR Value 100MEG
SYMATTR InstName R13
SYMBOL res -1968 -720 R0
WINDOW 3 82 39 Left 0
SYMATTR Value 100MEG
SYMATTR InstName R14
SYMBOL res -1968 -816 R0
WINDOW 3 97 40 Left 0
SYMATTR Value 100MEG
SYMATTR InstName R15
SYMBOL res -1968 -592 R0
WINDOW 3 82 39 Left 0
SYMATTR Value 100MEG
SYMATTR InstName R16
SYMBOL Folder_ADCbit -1344 -1312 R0
SYMATTR InstName X1
SYMBOL Folder_ADCbit -1344 -912 R0
SYMATTR InstName X2
SYMBOL Folder_ADCbit -1360 -480 R0
SYMATTR InstName X3
SYMBOL Folder_ADCbit -1360 -48 R0
SYMATTR InstName X4
SYMBOL Folder_ADCbit -880 -1312 R0
SYMATTR InstName X5
SYMBOL Folder_ADCbit -880 -864 R0
SYMATTR InstName X6
SYMBOL Folder_ADCbit -896 -432 R0
SYMATTR InstName X7
SYMBOL Folder_ADCbit -896 0 R0
SYMATTR InstName X8
SYMBOL Folder_ADCbit -432 -1312 R0
SYMATTR InstName X9
SYMBOL Folder_ADCbit -432 -864 R0
SYMATTR InstName X10
SYMBOL Folder_ADCbit -448 -432 R0
SYMATTR InstName X11
SYMBOL Folder_ADCbit 16 -1296 R0
SYMATTR InstName X12
SYMBOL Folder_ADCbit -464 0 R0
SYMATTR InstName X13
SYMBOL Folder_ADCbit 32 -864 R0
SYMATTR InstName X14
SYMBOL Folder_ADCbit 16 -432 R0
SYMATTR InstName X15
SYMBOL Folder_ADCbit 16 0 R0
SYMATTR InstName X16
SYMBOL res -992 -1296 R90
WINDOW 0 0 56 VBottom 0
WINDOW 3 32 56 VTop 0
SYMATTR InstName R17
SYMATTR Value 10k
SYMBOL res -992 -896 R90
WINDOW 0 0 56 VBottom 0
WINDOW 3 32 56 VTop 0
SYMATTR InstName R18
SYMATTR Value 10k
SYMBOL res -1008 -464 R90
WINDOW 0 0 56 VBottom 0
WINDOW 3 32 56 VTop 0
SYMATTR InstName R19
SYMATTR Value 10k
SYMBOL res -1008 -32 R90
WINDOW 0 0 56 VBottom 0
WINDOW 3 32 56 VTop 0
SYMATTR InstName R20
SYMATTR Value 10k
SYMBOL res -528 -848 R90
WINDOW 0 0 56 VBottom 0
WINDOW 3 32 56 VTop 0
SYMATTR InstName R21
SYMATTR Value 10k
SYMBOL res -528 -1296 R90
WINDOW 0 0 56 VBottom 0
WINDOW 3 32 56 VTop 0
SYMATTR InstName R22
SYMATTR Value 10k
SYMBOL res -544 -416 R90
WINDOW 0 0 56 VBottom 0
WINDOW 3 32 56 VTop 0
SYMATTR InstName R23
SYMATTR Value 10k
SYMBOL res -544 16 R90
WINDOW 0 0 56 VBottom 0
WINDOW 3 32 56 VTop 0
SYMATTR InstName R24
SYMATTR Value 10k
SYMBOL res -112 16 R90
WINDOW 0 0 56 VBottom 0
WINDOW 3 32 56 VTop 0
SYMATTR InstName R25
SYMATTR Value 10k
SYMBOL res 384 -848 R90
WINDOW 0 0 56 VBottom 0
WINDOW 3 32 56 VTop 0
SYMATTR InstName R26
SYMATTR Value 10k
SYMBOL res 368 -416 R90
WINDOW 0 0 56 VBottom 0
WINDOW 3 32 56 VTop 0
SYMATTR InstName R27
SYMATTR Value 10k
SYMBOL res 368 16 R90
WINDOW 0 0 56 VBottom 0
WINDOW 3 32 56 VTop 0
SYMATTR InstName R28
SYMATTR Value 10k
SYMBOL res -80 -1296 R90
WINDOW 0 0 56 VBottom 0
WINDOW 3 32 56 VTop 0
SYMATTR InstName R29
SYMATTR Value 10k
SYMBOL res -80 -848 R90
WINDOW 0 0 56 VBottom 0
WINDOW 3 32 56 VTop 0
SYMATTR InstName R30
SYMATTR Value 10k
SYMBOL res -96 -416 R90
WINDOW 0 0 56 VBottom 0
WINDOW 3 32 56 VTop 0
SYMATTR InstName R31
SYMATTR Value 10k
SYMBOL res 368 -1280 R90
WINDOW 0 0 56 VBottom 0
WINDOW 3 32 56 VTop 0
SYMATTR InstName R32
SYMATTR Value 10k
SYMBOL e -1552 -992 R0
SYMATTR InstName E1
SYMATTR Value 1.1
SYMBOL bv -2288 -352 R0
WINDOW 123 18 143 Left 0
SYMATTR Value2 +v(vfold9)+v(vfold10)+v(vfold11)+v(vfold12)+v(vfold13)+v(vfold14)+v(vfold15)+v(vfold16)
SYMATTR InstName B1
SYMATTR Value V=v(vfold0)+v(vfold2)+v(vfold3)+v(vfold4)+v(vfold5)+v(vfold6)+v(vfold7)+v(vfold8)
TEXT -1728 -1176 Left 0 ;No level shift here.

folder_adcbit.asc, the sub-circuit schematic file:
Version 4
SHEET 1 880 680
WIRE 32 -224 32 -272
WIRE 304 -224 304 -272
WIRE -16 -208 -64 -208
WIRE 400 -208 352 -208
WIRE -16 -160 -64 -160
WIRE 400 -160 352 -160
WIRE 32 -96 32 -144
WIRE 176 -96 32 -96
WIRE 304 -96 304 -144
WIRE 304 -96 176 -96
WIRE -1280 -48 -1280 -96
WIRE -752 -48 -752 -96
WIRE -400 -48 -416 -48
WIRE -352 -48 -400 -48
WIRE 176 -48 176 -96
WIRE -1328 -32 -1376 -32
WIRE -800 -32 -848 -32
WIRE 128 -32 80 -32
WIRE -1328 16 -1376 16
WIRE -800 16 -848 16
WIRE 128 16 80 16
WIRE -752 48 -752 32
WIRE -592 48 -752 48
WIRE -1280 64 -1280 32
WIRE -1120 64 -1280 64
WIRE -752 64 -752 48
WIRE 176 64 176 32
WIRE 336 64 176 64
WIRE -1280 80 -1280 64
WIRE -800 80 -848 80
WIRE 176 80 176 64
WIRE -1328 96 -1376 96
WIRE 128 96 80 96
WIRE -400 112 -416 112
WIRE -352 112 -400 112
WIRE -800 128 -848 128
WIRE -1328 144 -1376 144
WIRE 128 144 80 144
WIRE -752 192 -752 144
WIRE -1280 208 -1280 160
WIRE 176 208 176 160
WIRE -400 288 -416 288
WIRE -352 288 -400 288
FLAG -848 -32 Vin
FLAG -848 16 VTHL
IOPIN -848 16 In
FLAG -1376 96 VTHH
FLAG -1376 144 Vin
FLAG -1120 64 Bitout2
FLAG -1280 208 0
FLAG -752 -96 VDD
FLAG 80 -32 Bitout
FLAG 80 16 VTHH
FLAG 80 96 VTHH
FLAG 80 144 Bitout
FLAG 336 64 Vout
IOPIN 336 64 Out
FLAG -304 16 0
FLAG -304 176 0
FLAG -304 -64 Bitout
IOPIN -304 -64 Out
FLAG -304 96 Vinl
FLAG -352 160 VTHL
FLAG -352 0 Bitout2
FLAG -400 -48 Bitout1
FLAG -400 112 Vin
FLAG -848 80 VTHL
FLAG -848 128 Vin
FLAG -592 48 Bitout1
FLAG -752 192 0
FLAG -1376 -32 Vin
IOPIN -1376 -32 In
FLAG -1376 16 VTHH
IOPIN -1376 16 In
FLAG -1280 -96 VDD
IOPIN -1280 -96 In
FLAG 176 208 0
FLAG -304 352 0
FLAG -304 272 Vinh
FLAG -352 336 Vin
FLAG -400 288 VTHH
FLAG -64 -208 Vctr
IOPIN -64 -208 In
FLAG -64 -160 VTHL
FLAG 32 -272 Vinh
FLAG 400 -208 VTHH
FLAG 400 -160 Vctr
FLAG 304 -272 Vinl
SYMBOL sw -752 48 M180
WINDOW 3 24 -12 Left 0
WINDOW 38 39 67 Left 0
WINDOW 0 38 33 Left 0
SYMATTR Value ""
SYMATTR SpiceModel switmod
SYMATTR InstName S1
SYMBOL sw -1280 176 M180
WINDOW 3 24 -12 Left 0
WINDOW 38 39 67 Left 0
WINDOW 0 38 33 Left 0
SYMATTR Value ""
SYMATTR SpiceModel switmod
SYMATTR InstName S2
SYMBOL sw 176 48 M180
WINDOW 3 24 -12 Left 0
WINDOW 38 39 67 Left 0
WINDOW 0 38 33 Left 0
SYMATTR Value ""
SYMATTR SpiceModel switmod
SYMATTR InstName S3
SYMBOL sw 176 176 M180
WINDOW 3 24 -12 Left 0
WINDOW 38 39 67 Left 0
WINDOW 0 38 33 Left 0
SYMATTR Value ""
SYMATTR SpiceModel switmod
SYMATTR InstName S4
SYMBOL e -304 -80 R0
SYMATTR InstName E1
SYMATTR Value 1.1
SYMBOL e -304 80 R0
SYMATTR InstName E2
SYMATTR Value 1
SYMBOL sw -752 160 M180
WINDOW 3 24 -12 Left 0
WINDOW 38 39 67 Left 0
WINDOW 0 38 33 Left 0
SYMATTR Value ""
SYMATTR SpiceModel switmod
SYMATTR InstName S5
SYMBOL sw -1280 48 M180
WINDOW 3 24 -12 Left 0
WINDOW 38 39 67 Left 0
WINDOW 0 38 33 Left 0
SYMATTR Value ""
SYMATTR SpiceModel switmod
SYMATTR InstName S6
SYMBOL e -304 256 R0
SYMATTR InstName E3
SYMATTR Value 1
SYMBOL sw 32 -128 M180
WINDOW 3 24 -12 Left 0
WINDOW 38 39 67 Left 0
WINDOW 0 38 33 Left 0
SYMATTR Value ""
SYMATTR SpiceModel switmod
SYMATTR InstName S7
SYMBOL sw 304 -128 R180
WINDOW 3 24 -12 Left 0
WINDOW 38 39 67 Left 0
WINDOW 0 38 33 Left 0
SYMATTR Value ""
SYMATTR SpiceModel switmod
SYMATTR InstName S8
TEXT -1200 296 Left 0 ;Determine if VTHL< vin < VTHH or not
TEXT -472 456 Left 0 ;Either Vin-VTHL or VTHH-Vin
TEXT 8 280 Left 0 ;Pass the analog voltage to the output
TEXT -624 -136 Left 0 !.model switmod SW

The netlist it stands for:
* 4_bit_Folding_ADC.asc
XU10 Vin OUTSH clock VDD Sample_and_hold  ; pins Vin Outsh Clock VDD
R15 VDD V1 1500MEG
R17 V1 0 100MEG
E2 Vref_fine 0 V1 0 1
XX2 VDD 0 Vfold B3 N001 N002 N003 N004 N005 N006 N007 N008 N009 N010 N011 N012 N013 N014 N015 N016 Vref_fine B1 B2 B0 4_bit_fine_adc_lsb
XX1 VDD N016 Vfold Vrefm N001 N002 N003 N004 N005 N006 N007 N008 N009 N010 N011 N012 N013 N014 N015 OUTSH 4bit_folder

* block symbol definitions
.subckt 4_bit_fine_adc_lsb VDD VREFM INSH B3 Reg1 Reg2 Reg3 Reg4 Reg5 Reg6 Reg7 Reg8 Reg9 Reg10 Reg11 Reg12 Reg13 Reg14 Reg15 Reg16 VREFP B1 B2 B0
R1 Vtrip 0 100MEG
R2 VDD Vtrip 100MEG
B1 VCM 0 V=(V(VREFP)-V(VREFM))/2
BPIP PIPIN 0 V=V(INSH)-V(VREFM)
XU1 VDD Vtrip VCM PIPIN B3_org N001 ADCbit  ; pins VDD Vtrip VCM Vin Bitout Vout
XU7 VDD Vtrip VCM N001 B2_org N002 ADCbit  ; pins VDD Vtrip VCM Vin Bitout Vout
XU8 VDD Vtrip VCM N002 B1_org N003 ADCbit  ; pins VDD Vtrip VCM Vin Bitout Vout
XU9 VDD Vtrip VCM N003 B0_org NC_01 ADCbit  ; pins VDD Vtrip VCM Vin Bitout Vout
XX1 B0_org B0i VDD inverter  ; pins In Out VDD
XX2 B1_org B1i VDD inverter  ; pins In Out VDD
XX3 B2_org B2i VDD inverter  ; pins In Out VDD
XX4 B3_org B3i VDD inverter  ; pins In Out VDD
XX5 VDD B0i B0 B0_org Reg1 Reg2 Reg3 Reg4 Reg5 Reg6 Reg7 Reg8 Reg9 Reg10 Reg11 Reg12 Reg13 Reg14 Reg15 Reg16 pg
XX6 VDD B1i B1 B1_org Reg1 Reg2 Reg3 Reg4 Reg5 Reg6 Reg7 Reg8 Reg9 Reg10 Reg11 Reg12 Reg13 Reg14 Reg15 Reg16 pg
XX7 VDD B2i B2 B2_org Reg1 Reg2 Reg3 Reg4 Reg5 Reg6 Reg7 Reg8 Reg9 Reg10 Reg11 Reg12 Reg13 Reg14 Reg15 Reg16 pg
XX8 VDD B3i B3 B3_org Reg1 Reg2 Reg3 Reg4 Reg5 Reg6 Reg7 Reg8 Reg9 Reg10 Reg11 Reg12 Reg13 Reg14 Reg15 Reg16 pg
* No level shift here.
* Setup common-mode voltage
.ends 4_bit_fine_adc_lsb

.subckt pg VDD VPL Bitout VPH Reg1 Reg2 Reg3 Reg4 Reg5 Reg6 Reg7 Reg8 Reg9 Reg10 Reg11 Reg12 Reg13 Reg14 Reg15 Reg16
S3 Bitout VPH Reg15 VDD switmod
S4 VPL Bitout Reg16 VDD switmod
S1 Bitout VPH Reg1 VDD switmod
S2 Bitout VPH Reg3 VDD switmod
S7 Bitout VPH Reg5 VDD switmod
S8 Bitout VPH Reg7 VDD switmod
S9 Bitout VPH Reg9 VDD switmod
S10 Bitout VPH Reg11 VDD switmod
S11 Bitout VPH Reg13 VDD switmod
S12 VPL Bitout Reg2 VDD switmod
S13 VPL Bitout Reg4 VDD switmod
S16 VPL Bitout Reg6 VDD switmod
S20 VPL Bitout Reg10 VDD switmod
S24 VPL Bitout Reg12 VDD switmod
S18 VPL Bitout Reg14 VDD switmod
S14 VPL Bitout Reg8 VDD switmod
.model switmod SW
.ends pg

.subckt 4bit_folder VDD Reg16 Vfold VREFM Reg1 Reg2 Reg3 Reg4 Reg5 Reg6 Reg7 Reg8 Reg9 Reg10 Reg11 Reg12 Reg13 Reg14 Reg15 OUTSH
R1 V15 V14 100MEG
R2 VDD V15 100MEG
BPIP1 PIPIN 0 V=V(OUTSH)-V(VREFM)
R3 V13 V12 100MEG
R4 V14 V13 100MEG
R5 V11 V10 100MEG
R6 V12 V11 100MEG
R7 V9 V8 100MEG
R8 V10 V9 100MEG
R9 V8 V7 100MEG
R10 V6 V5 100MEG
R11 V7 V6 100MEG
R12 V4 V3 100MEG
R13 V5 V4 100MEG
R14 V2 V1 100MEG
R15 V3 V2 100MEG
R16 V1 0 100MEG
XX1 VDD V15 V16 PIPIN Vfold0 VDD Reg16 folder_adcbit
XX2 V15 V14 0 PIPIN Vfold5 VDD Reg15 folder_adcbit
XX3 V14 V13 VDD PIPIN Vfold9 VDD Reg14 folder_adcbit
XX4 V13 V12 0 PIPIN Vfold13 VDD Reg13 folder_adcbit
XX5 V12 V11 VDD PIPIN Vfold2 VDD Reg12 folder_adcbit
XX6 V11 V10 0 PIPIN Vfold6 VDD Reg11 folder_adcbit
XX7 V10 V9 VDD PIPIN Vfold10 VDD Reg10 folder_adcbit
XX8 V9 V8 0 PIPIN Vfold14 VDD Reg9 folder_adcbit
XX9 V8 V7 VDD PIPIN Vfold3 VDD Reg8 folder_adcbit
XX10 V7 V6 0 PIPIN Vfold7 VDD Reg7 folder_adcbit
XX11 V6 V5 VDD PIPIN Vfold11 VDD Reg6 folder_adcbit
XX12 V4 V3 VDD PIPIN Vfold4 VDD Reg4 folder_adcbit
XX13 V5 V4 0 PIPIN Vfold15 VDD Reg5 folder_adcbit
XX14 V3 V2 0 PIPIN Vfold8 VDD Reg3 folder_adcbit
XX15 V2 V1 VDD PIPIN Vfold12 VDD Reg2 folder_adcbit
XX16 V1 0 0 PIPIN Vfold16 VDD Reg1 folder_adcbit
R17 Vfold1 Vfold0 10k
R18 Vfold1 Vfold5 10k
R19 Vfold1 Vfold9 10k
R20 Vfold1 Vfold13 10k
R21 Vfold1 Vfold6 10k
R22 Vfold1 Vfold2 10k
R23 Vfold1 Vfold10 10k
R24 Vfold1 Vfold14 10k
R25 Vfold1 Vfold15 10k
R26 Vfold1 Vfold8 10k
R27 Vfold1 Vfold12 10k
R28 Vfold1 Vfold16 10k
R29 Vfold1 Vfold3 10k
R30 Vfold1 Vfold7 10k
R31 Vfold1 Vfold11 10k
R32 Vfold1 Vfold4 10k
E1 V16 0 VDD 0 1.1
B1 Vfold 0 V=v(vfold0)+v(vfold2)+v(vfold3)+v(vfold4)+v(vfold5)+v(vfold6)+v(vfold7)+v(vfold8) +v(vfold9)+v(vfold10)+v(vfold11)+v(vfold12)+v(vfold13)+v(vfold14)+v(vfold15)+v(vfold16)
* No level shift here.
.ends 4bit_folder

.subckt folder_adcbit VTHH VTHL Vctr Vin Vout VDD Bitout
S1 Bitout1 VDD Vin VTHL switmod
S2 0 Bitout2 VTHH Vin switmod
S3 Vout N001 Bitout VTHH switmod
S4 0 Vout VTHH Bitout switmod
E1 Bitout 0 Bitout1 Bitout2 1.1
E2 Vinl 0 Vin VTHL 1
S5 0 Bitout1 VTHL Vin switmod
S6 Bitout2 VDD Vin VTHH switmod
E3 Vinh 0 VTHH Vin 1
S7 N001 Vinh Vctr VTHL switmod
S8 N001 Vinl VTHH Vctr switmod
* Determine if VTHL< vin < VTHH or not
* Either Vin-VTHL or VTHH-Vin
* Pass the analog voltage to the output
.model switmod SW
.ends folder_adcbit

* Sample and Hold
* Setup reference voltage for fine ADC
* simply VDD divided by 2^N/2 (here 16)
.backanno
.end